# Altium schematic sheet Cube_Kordinaten_Schema.SchDoc
size A2
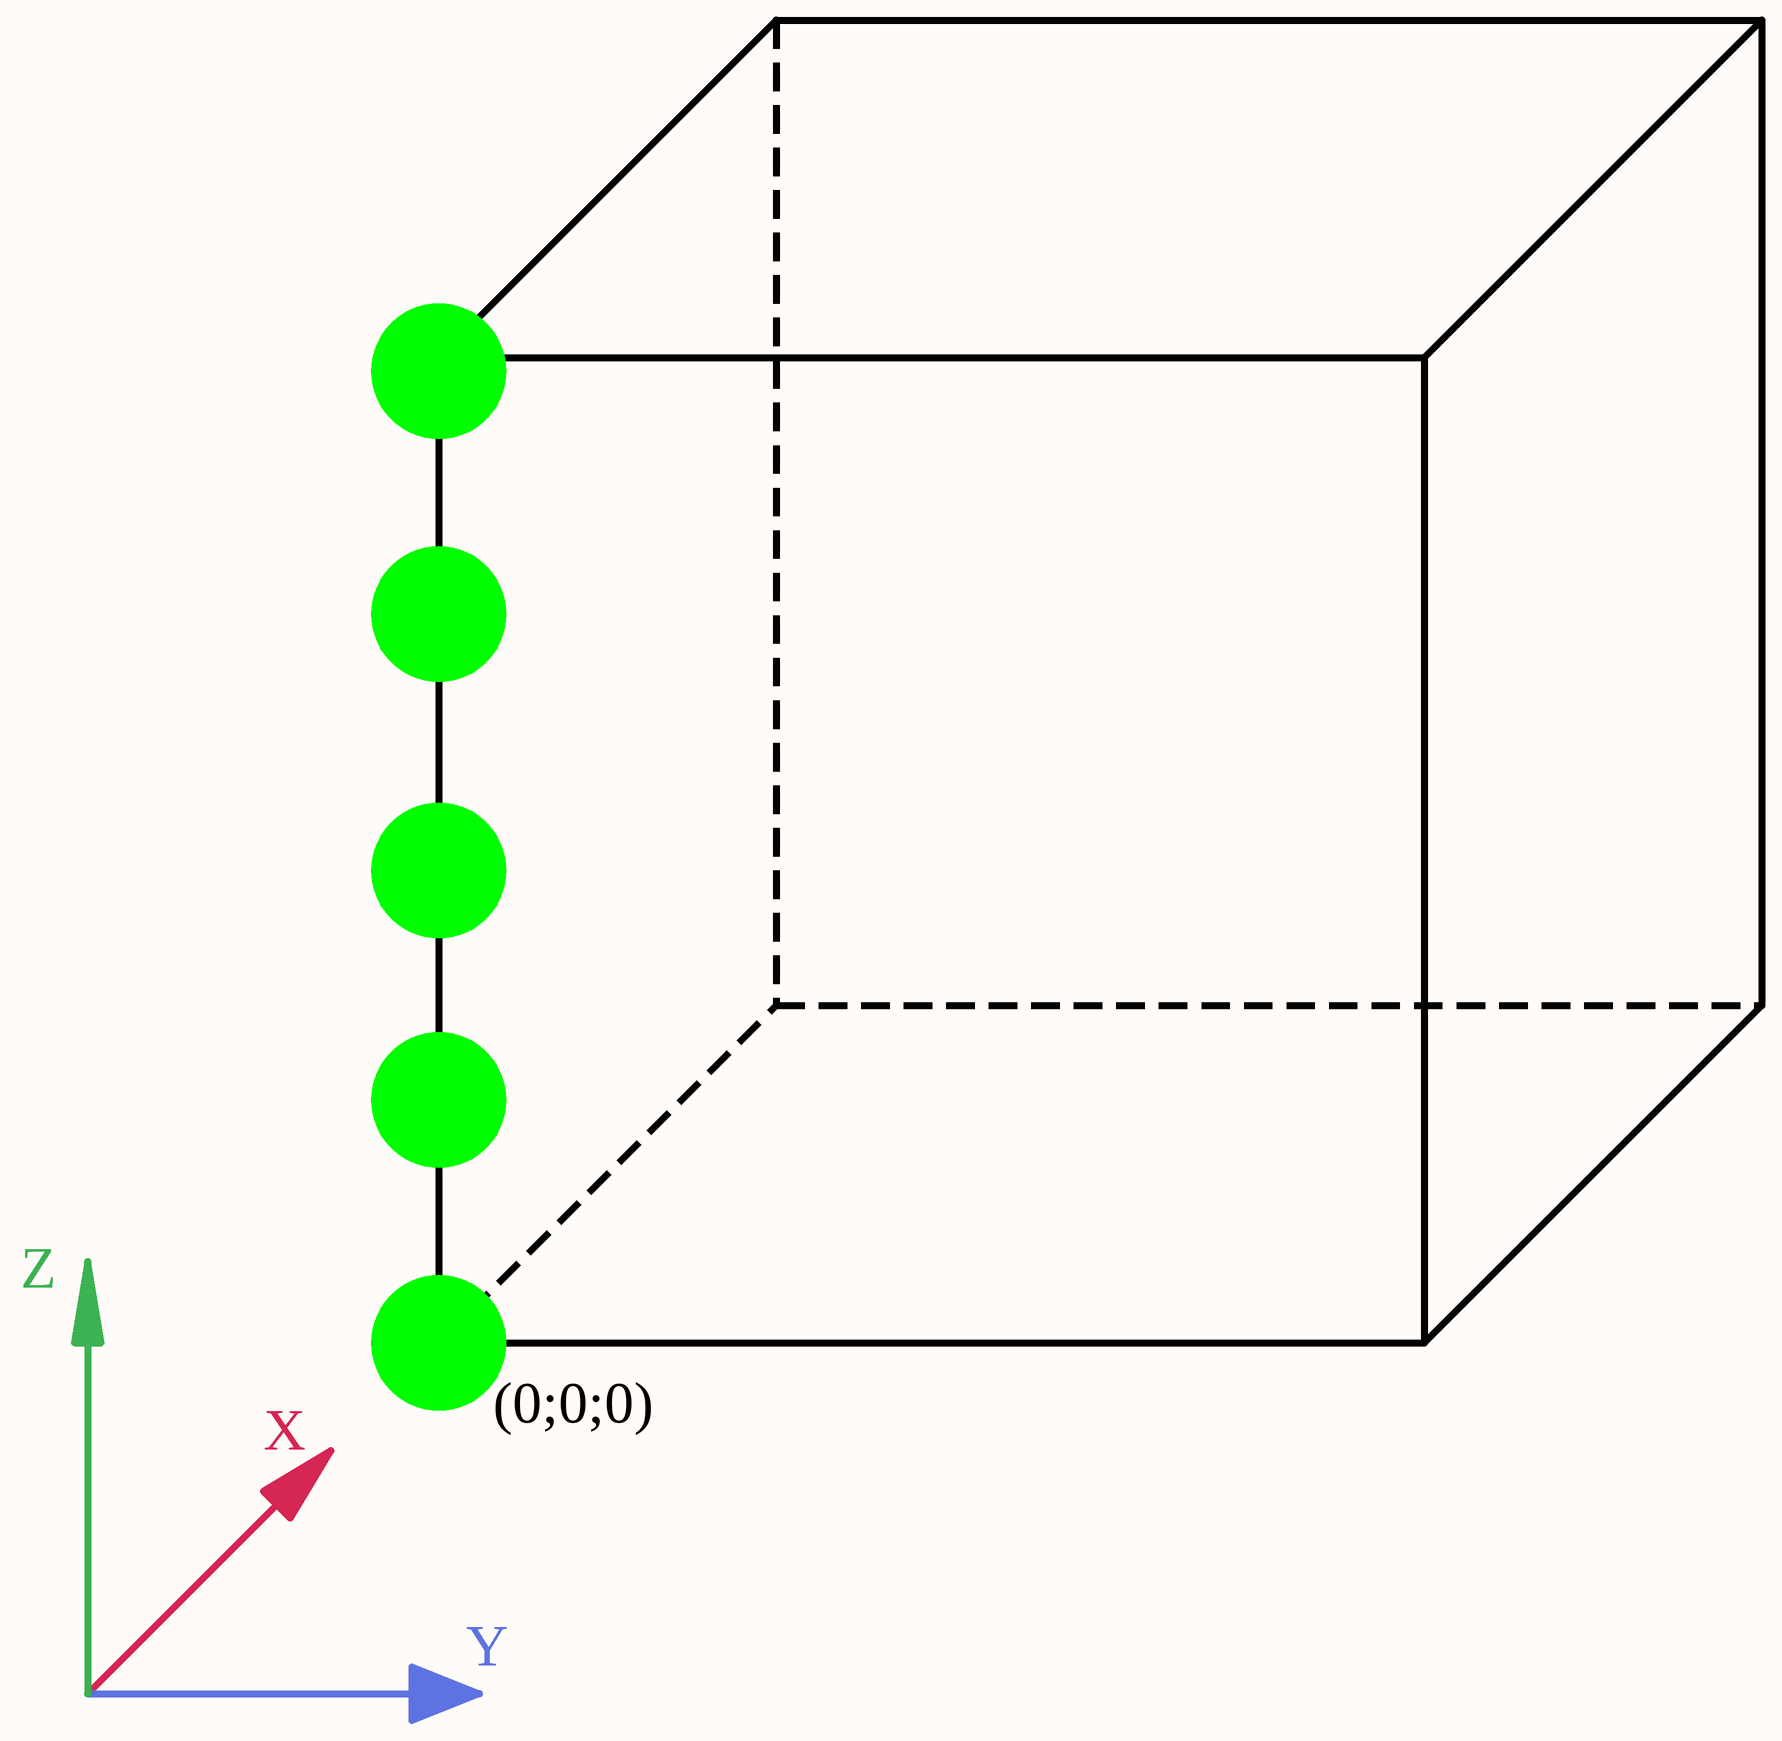
[diagram p0: Cube_Kordinaten_Schema.SchDoc]

## Notes on the sheet
- Z
- X
- (0;0;0)
- Y